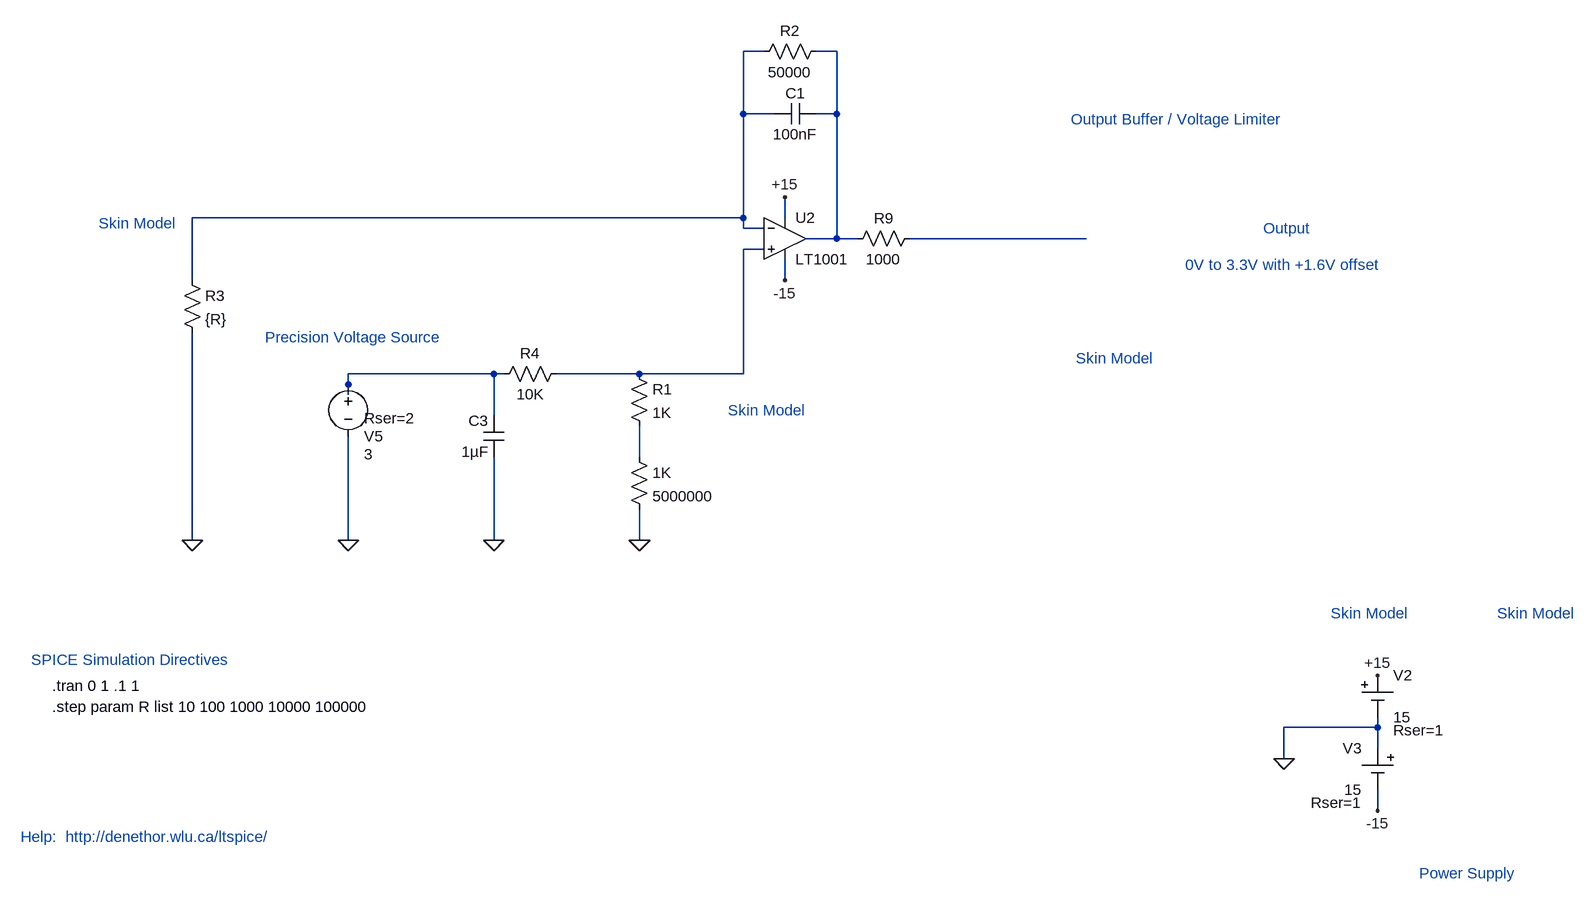
[diagram p0: schematic GSR.asc]
GSR.asc, the LTspice schematic file:
Version 4
SHEET 1 1356 1016
WIRE -208 -352 -240 -352
WIRE -96 -352 -128 -352
WIRE -240 -256 -240 -352
WIRE -192 -256 -240 -256
WIRE -96 -256 -96 -352
WIRE -96 -256 -128 -256
WIRE -240 -96 -240 -256
WIRE -240 -96 -1088 -96
WIRE -176 -96 -176 -128
WIRE -240 -80 -240 -96
WIRE -208 -80 -240 -80
WIRE -96 -64 -96 -256
WIRE -96 -64 -144 -64
WIRE -64 -64 -96 -64
WIRE 288 -64 16 -64
WIRE -208 -48 -240 -48
WIRE -1088 0 -1088 -96
WIRE -176 0 -176 -32
WIRE -624 144 -848 144
WIRE -608 144 -624 144
WIRE -400 144 -528 144
WIRE -240 144 -240 -48
WIRE -240 144 -400 144
WIRE -848 160 -848 144
WIRE -848 176 -848 160
WIRE -624 208 -624 144
WIRE -400 272 -400 224
WIRE -1088 400 -1088 80
WIRE -848 400 -848 240
WIRE -624 400 -624 272
WIRE -400 400 -400 352
WIRE 736 688 736 672
WIRE 736 688 592 688
WIRE 736 720 736 688
WIRE 592 736 592 688
WIRE 736 816 736 784
FLAG 736 608 +15
FLAG 736 816 -15
FLAG 592 736 0
FLAG -176 0 -15
FLAG -176 -128 +15
FLAG -400 400 0
FLAG -624 400 0
FLAG -848 400 0
FLAG -1088 400 0
SYMBOL Opamps\\LT1001 -176 -128 R0
SYMATTR InstName U2
SYMBOL Misc\\cell 736 608 R0
WINDOW 123 0 0 Left 2
WINDOW 39 24 84 Left 2
SYMATTR SpiceLine Rser=1
SYMATTR InstName V2
SYMATTR Value 15
SYMBOL Misc\\cell 736 720 M0
WINDOW 123 0 0 Left 2
WINDOW 39 24 84 Left 2
SYMATTR SpiceLine Rser=1
SYMATTR InstName V3
SYMATTR Value 15
SYMBOL res -112 -368 R90
WINDOW 0 0 56 VBottom 2
WINDOW 3 32 56 VTop 2
SYMATTR InstName R2
SYMATTR Value 50000
SYMBOL res 32 -80 R90
WINDOW 0 0 56 VBottom 2
WINDOW 3 32 56 VTop 2
SYMATTR InstName R9
SYMATTR Value 1000
SYMBOL cap -128 -272 R90
WINDOW 0 0 32 VBottom 2
WINDOW 3 32 32 VTop 2
SYMATTR InstName C1
SYMATTR Value 100nF
SYMBOL res -416 128 R0
SYMATTR InstName R1
SYMATTR Value 1K
SYMBOL res -416 256 R0
SYMATTR InstName 1K
SYMATTR Value 5000000
SYMBOL res -512 128 R90
WINDOW 0 0 56 VBottom 2
WINDOW 3 32 56 VTop 2
SYMATTR InstName R4
SYMATTR Value 10K
SYMBOL cap -608 272 R180
WINDOW 0 24 56 Left 2
WINDOW 3 24 8 Left 2
SYMATTR InstName C3
SYMATTR Value 1µF
SYMBOL voltage -848 144 R0
WINDOW 0 24 96 Left 2
WINDOW 3 24 124 Left 2
WINDOW 39 24 68 Left 2
WINDOW 123 0 0 Left 2
SYMATTR InstName V5
SYMATTR Value 3
SYMATTR SpiceLine Rser=2
SYMBOL res -1104 -16 R0
SYMATTR InstName R3
SYMATTR Value {R}
TEXT 800 912 Left 2 ;Power Supply
TEXT -1352 856 Left 2 ;Help:  http://denethor.wlu.ca/ltspice/
TEXT -1336 584 Left 2 ;SPICE Simulation Directives
TEXT -1304 624 Left 2 !.tran 0 1 .1 1
TEXT 560 -80 Left 2 ;Output
TEXT 440 -24 Left 2 ;0V to 3.3V with +1.6V offset
TEXT 264 -248 Left 2 ;Output Buffer / Voltage Limiter
TEXT -1232 -88 Left 2 ;Skin Model
TEXT 272 120 Left 2 ;Skin Model
TEXT -264 200 Left 2 ;Skin Model
TEXT 664 512 Left 2 ;Skin Model
TEXT 920 512 Left 2 ;Skin Model
TEXT -976 88 Left 2 ;Precision Voltage Source
TEXT -1304 656 Left 2 !.step param R list 10 100 1000 10000 100000

The netlist it stands for:
* GSR.asc
XU2 N004 N001 +15 -15 N002 LT1001  ; pins In+ In- V+ V- OUT
V2 +15 0 15 Rser=1
V3 0 -15 15 Rser=1
R2 N002 N001 50000
R9 N003 N002 1000
C1 N002 N001 100nF
R1 N004 N006 1K
R§1K N006 0 5000000
R4 N004 N005 10K
C3 0 N005 1µF
V5 N005 0 3 Rser=2
R3 N001 0 {R}
* Power Supply
* Help:  http://denethor.wlu.ca/ltspice/
* SPICE Simulation Directives
.tran 0 1 .1 1
* Output
* 0V to 3.3V with +1.6V offset
* Output Buffer / Voltage Limiter
* Skin Model
* Skin Model
* Skin Model
* Skin Model
* Skin Model
* Precision Voltage Source
.step param R list 10 100 1000 10000 100000
.lib LTC.lib
.backanno
.end